# EAGLE design keypad (EAGLE 9.3.0)
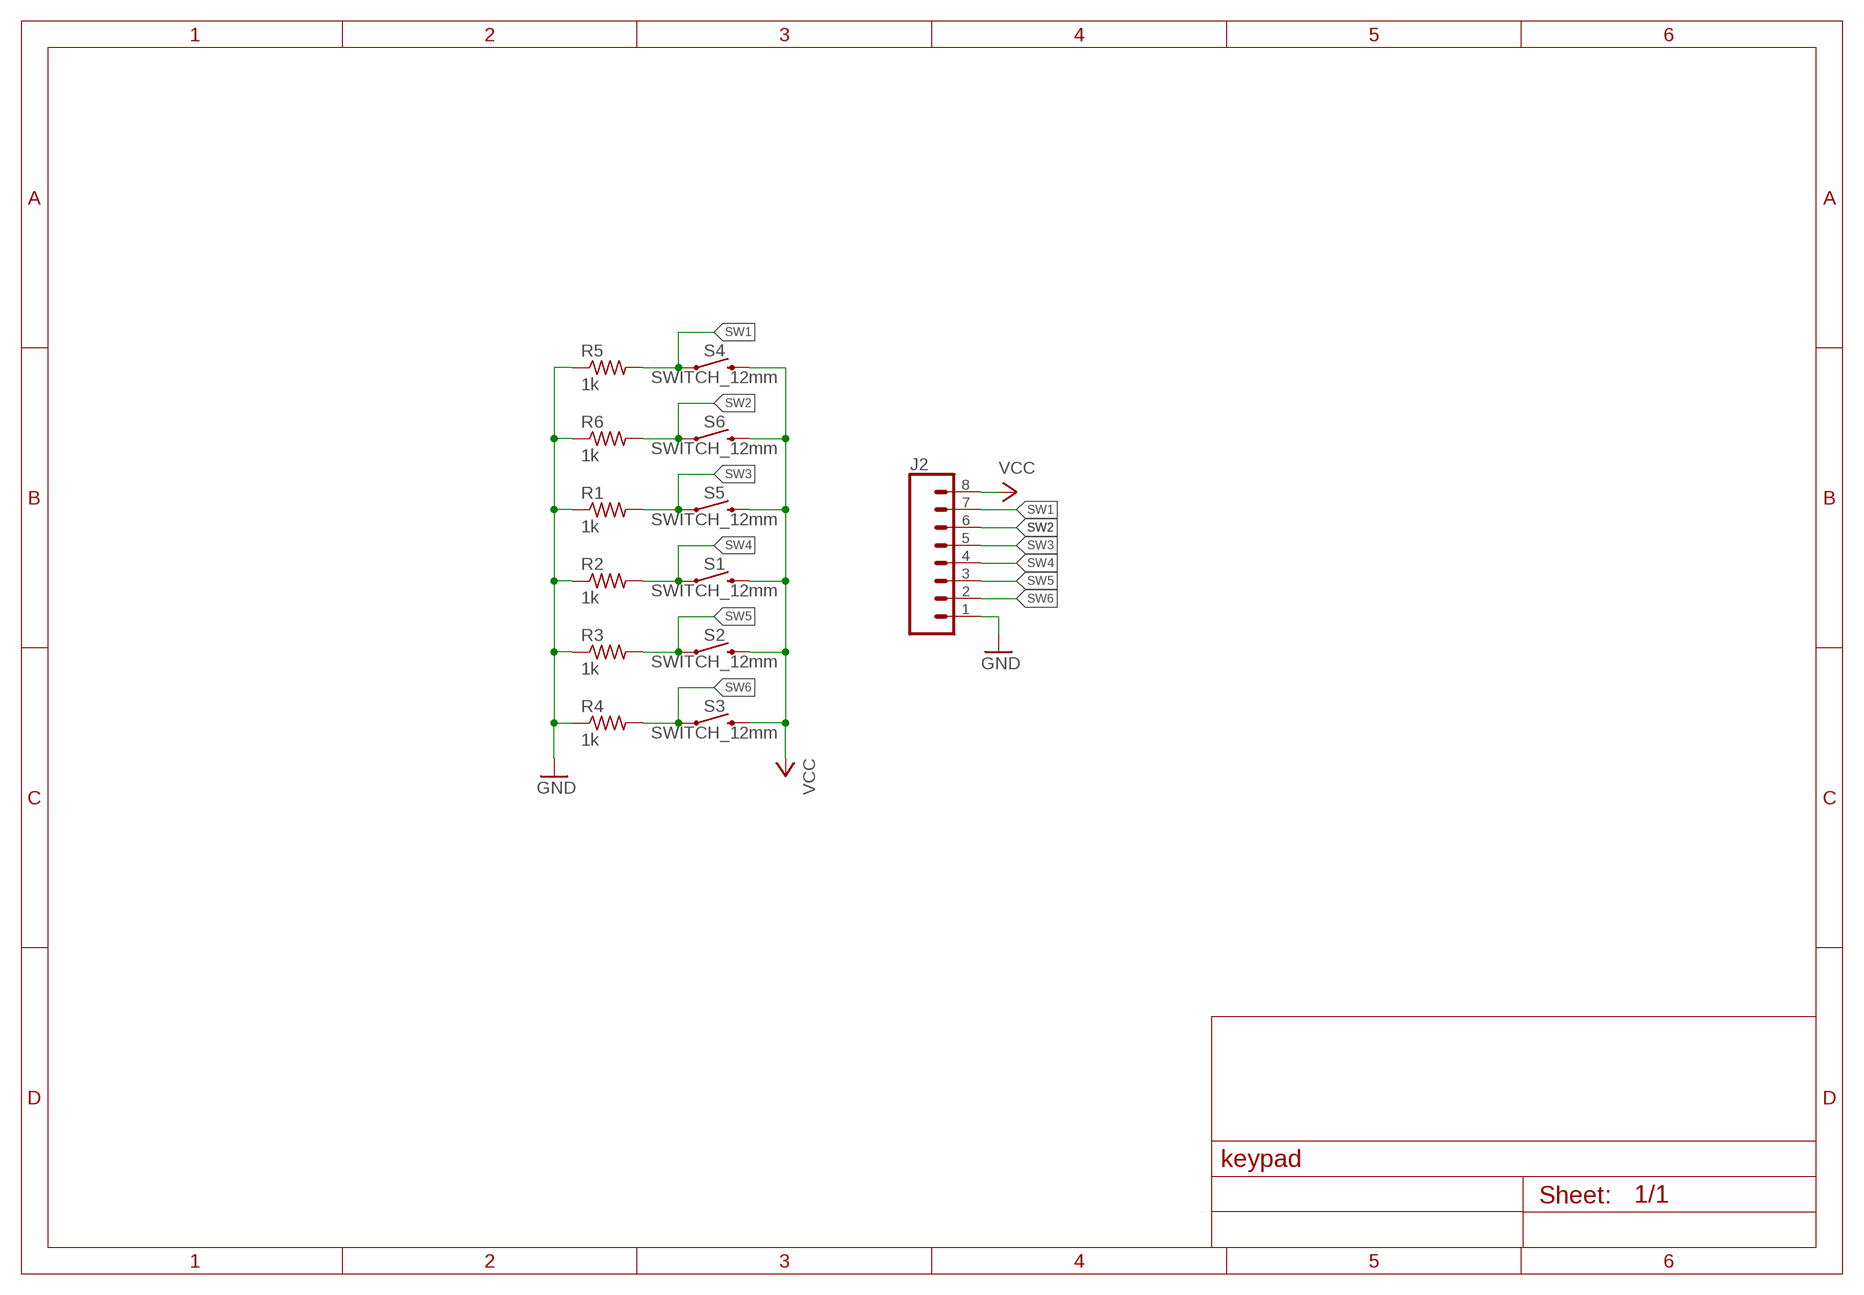
[diagram p0: schematic, sheet 1]

## Parts
J2  CONN_08LONGPADS  [1X08_LONGPADS]
R1  1k  R-US_0207/10  [0207/10]
R2  1k  R-US_0207/10  [0207/10]
R3  1k  R-US_0207/10  [0207/10]
R4  1k  R-US_0207/10  [0207/10]
R5  1k  R-US_0207/10  [0207/10]
R6  1k  R-US_0207/10  [0207/10]
S1  SWITCH_12mm  MOMENTARY-SWITCH-SPST-PTH-12MM  [TACTILE_SWITCH_PTH_12MM]
S2  SWITCH_12mm  MOMENTARY-SWITCH-SPST-PTH-12MM  [TACTILE_SWITCH_PTH_12MM]
S3  SWITCH_12mm  MOMENTARY-SWITCH-SPST-PTH-12MM  [TACTILE_SWITCH_PTH_12MM]
S4  SWITCH_12mm  MOMENTARY-SWITCH-SPST-PTH-12MM  [TACTILE_SWITCH_PTH_12MM]
S5  SWITCH_12mm  MOMENTARY-SWITCH-SPST-PTH-12MM  [TACTILE_SWITCH_PTH_12MM]
S6  SWITCH_12mm  MOMENTARY-SWITCH-SPST-PTH-12MM  [TACTILE_SWITCH_PTH_12MM]

## Nets
GND: J2.1 R1.1 R2.1 R3.1 R4.1 R5.1 R6.1
SW1: J2.7 R5.2 S4.1
SW2: J2.6 R6.2 S6.1
SW3: J2.5 R1.2 S5.1
SW4: J2.4 R2.2 S1.1
SW5: J2.3 R3.2 S2.1
SW6: J2.2 R4.2 S3.1
VCC: J2.8 S1.3 S2.3 S3.3 S4.3 S5.3 S6.3

## Library data of the parts
J2 = SparkFun-Connectors:CONN_08: Multi connection point. Often used as Generic Header-pin footprint for 0.1 inch spaced/style header connections On any of the 0.1 inch spaced packages, you can populate with these: Break Away Headers - Straight <https://www.sparkfun.com/products/116> (PRT-00116) Break Away Male Headers - Right Angle <https://www.sparkfun.com/products/553> (PRT-00553) Female Headers <https://www.sparkfun.com/products/115> (PRT-00115) Break Away Headers - Machine Pin <https://www.sparkfun.com/products/117> (PRT-00117) Break Away Female Headers - Swiss Machine Pin <https://www.sparkfun.com/products/743> (PRT-00743) Arduino Stackable Header - 8 Pin <https://www.sparkfun.com/products/9279> (PRT-09279) For SCREWTERMINALS and SPRING TERMINALS visit here: Screw Terimnals on SparkFun.com <https://www.sparkfun.com/search/results?term=Screw+Terminals> (5mm/3.5mm/2.54mm spacing) This device is also useful as a general connection point to wire up your design to another part of your project. Our various solder wires solder well into these plated through hole pads. Hook-Up Wire - Assortment (Stranded, 22 AWG) <https://www.sparkfun.com/products/11375> (PRT-11375) Hook-Up Wire - Assortment (Solid Core, 22 AWG) <https://www.sparkfun.com/products/11367> (PRT-11367) View the entire wire category on our website here <https://www.sparkfun.com/categories/141> Special notes: Molex polarized connector foot print use with SKU : PRT-08231 with associated crimp pins and housings. 1MM SMD Version SKU: PRT-10208 NOTES ON THE VARIANTS LOCK and LOCK_LONGPADS... This footprint was designed to help hold the alignment of a through-hole component (i.e. 6-pin header) while soldering it into place. You may notice that each hole has been shifted either up or down by 0.005 of an inch from it's more standard position (which is a perfectly straight line). This slight alteration caused the pins (the squares in the middle) to touch the edges of the holes. Because they are alternating, it causes a "brace" to hold the component in place. 0.005 has proven to be the perfect amount of "off-center" position when using our standard breakaway headers. Although looks a little odd when you look at the bare footprint, once you have a header in there, the alteration is very hard to notice. Also,if you push a header all the way into place, it is covered up entirely on the bottom side.
R1-R6 = BeagleBone_Black_Wireless:R-US_: RESISTOR, American symbol
S1-S6 = SparkFun-Switches:MOMENTARY-SWITCH-SPST: Momentary Switch (Pushbutton) - SPST Normally-open (NO) SPST momentary switches (buttons, pushbuttons). Variants PTH-12MM - 12mm square, through-hole Momentary Pushbutton Switch - 12mm Square <https://www.sparkfun.com/products/9190> (COM-09190) PTH-6.0MM, PTH-6.0MM-KIT - 6.0mm square, through-hole Mini Pushbutton Switch <https://www.sparkfun.com/products/97> (COM-00097) KIT package intended for soldering kit's - only one side of pads' copper is exposed. PTH-RIGHT-ANGLE-KIT - Right-angle, through-hole Right Angle Tactile Button <https://www.sparkfun.com/products/10791> - Used on SparkFun BigTime Watch Kit <https://www.sparkfun.com/products/11734> SMD-12MM - 12mm square, surface-mount Tactile Button - SMD (12mm) <https://www.sparkfun.com/products/12993> (COM-12993) Used on SparkFun PicoBoard <https://www.sparkfun.com/products/11888> SMD-4.5MM - 4.5mm Square Trackball Switch Used on SparkFun Blackberry Trackballer Breakout <https://www.sparkfun.com/products/13169> SMD-4.6MMX2.8MM - 4.60mm x 2.80mm, surface mount Used on SparkFun SAMD21 Mini Breakout <https://www.sparkfun.com/products/13664> SMD-5.2MM, SMD-5.2-REDUNDANT - 5.2mm square, surface-mount Mini Pushbutton Switch - SMD <https://www.sparkfun.com/products/8720> (COM-08720) Used on Arduino Pro Mini <https://www.sparkfun.com/products/11114> REDUNDANT package connects both switch circuits together SMD-6.0X3.5MM - 6.0 x 3.5mm, surface mount Momentary Reset Switch SMD <https://www.sparkfun.com/products/8229> (COM-08229) SMD-6.2MM-TALL - 6.2mm square, surface mount Tactile Button - SMD (6mm) <https://www.sparkfun.com/products/12992> Used on SparkFun Digital Sandbox <https://www.sparkfun.com/products/12651> SMD-RIGHT-ANGLE - Right-angle, surface mount Used on SparkFun Block for Intel® Edison - Arduino <https://www.sparkfun.com/products/13036>; PROD_ID: SWCH-09185; SF_SKU: COM-09190

## Board
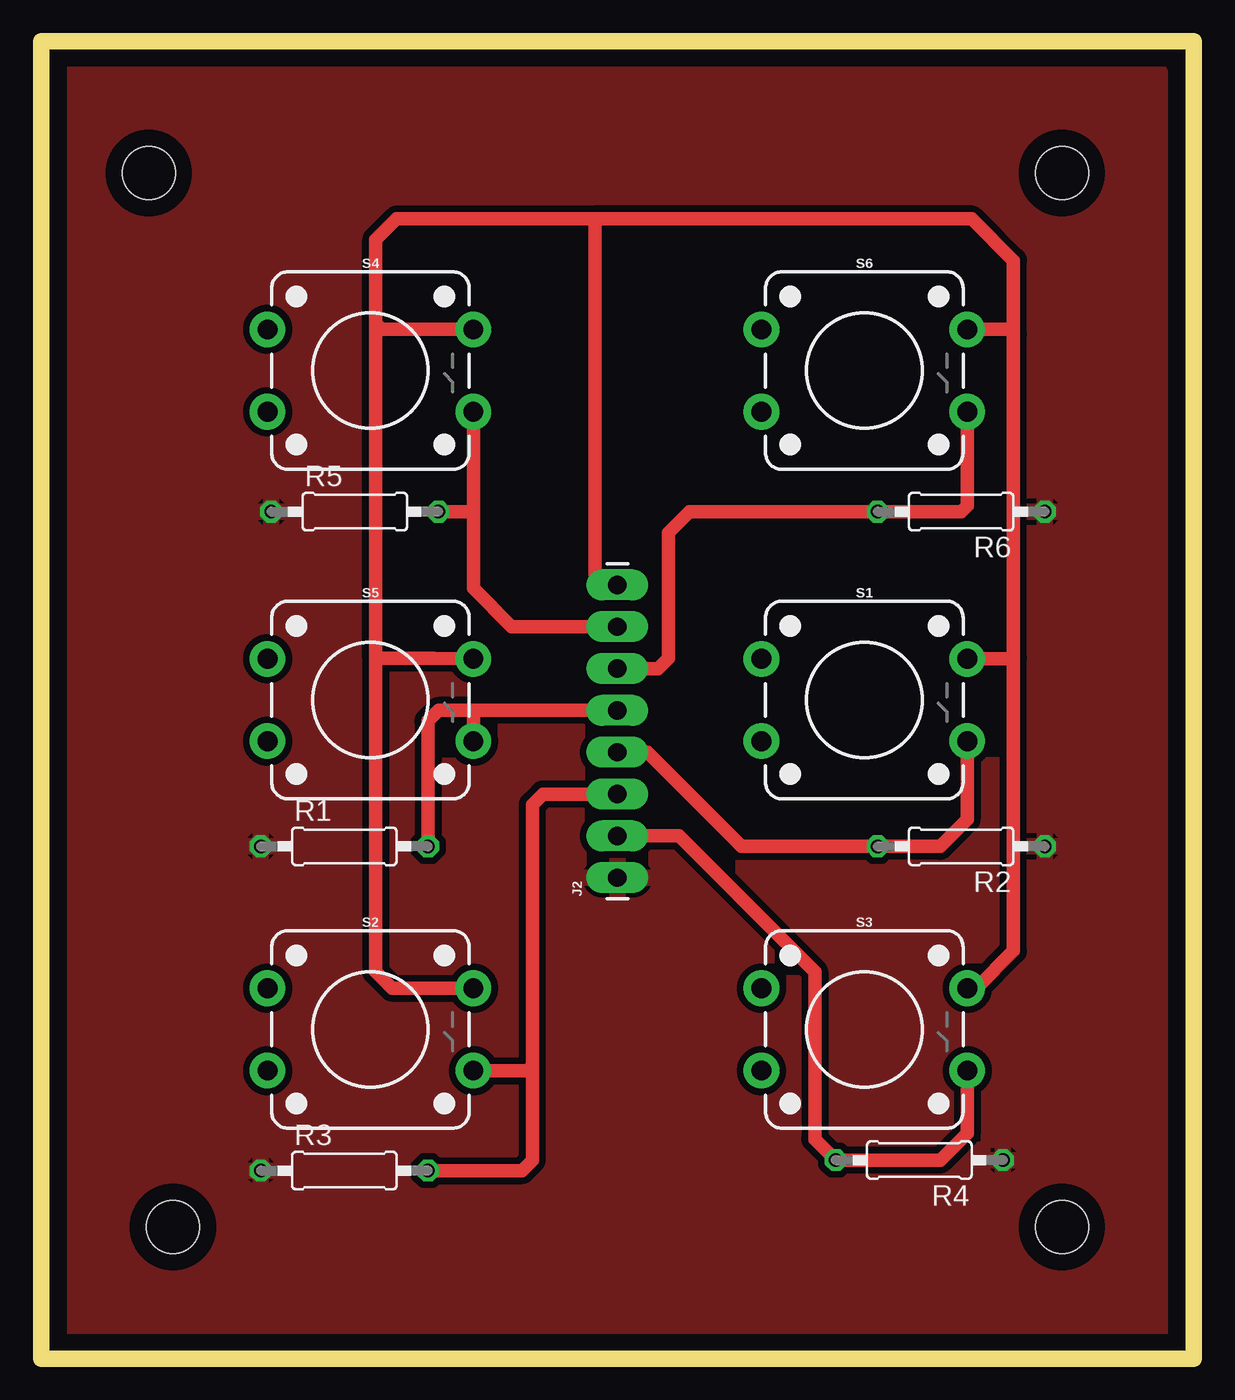
[diagram p1: board, top side]

Size 70 x 80 mm. Coordinates in mm from the lower left corner, seen from the top.
Outline: 0,0 70,0 70,80 0,80 0,0
Copper layers (1*16): Top 0.035mm / dielectric 1.5mm / Bottom 0.035mm
Design rules "default *": minimum track width 16mil, minimum drill 0.35mm, track to track 16mil, track to pad 16mil, pad to pad 16mil, via to via 16mil, smd to smd 16mil, copper to edge 40mil, drill to drill 6mil, minimum pad ring 10mil, minimum via ring 8mil, stop-mask expansion 4mil, vias tented up to drill 0mil, thermal gap 10mil
Holes 3.2 mm at 62,72 62,8 8,8 6.54,72

### Footprints (pad centres in the part's own frame; a part is rotated, then mirrored left to right if it is on the bottom)
1X08_LONGPADS = drill 1.118 pad 1.88 long: 1 0,0; 2 2.54,0; 3 5.08,0; 4 7.62,0; 5 10.16,0; 6 12.7,0; 7 15.24,0; 8 17.78,0
0207/10 = drill 0.813 octagon: 1 -5.08,0; 2 5.08,0
TACTILE_SWITCH_PTH_12MM = drill 1.2 pad 2.159: 1 6.25,-2.5; 2 -6.25,-2.5; 3 6.25,2.5; 4 -6.25,2.5

### Placement (x,y rotation side)
J2  35,29.21 90 top
R1  18.41,31.11 0 top
R2  55.88,31.11 180 top
R3  18.41,11.43 0 top
R4  53.34,12.06 180 top
R5  19.05,51.44 0 top
R6  55.88,51.44 180 top
S1  50,40 0 top
S2  20,20 0 top
S3  50,20 0 top
S4  20,60 0 top
S5  20,40 0 top
S6  50,60 0 top

### Tracks (layer width: path | path; a pad name or v marks a point on that pad's centre or on a via)
GND
  pour Top (isolate 0.406): 1.91,78.11 67.94,78.11 67.94,1.27 1.91,1.27
SW1
  Top 0.813: S4.1 26.25,51.44 | 26.25,51.44 26.25,46.77 28.57,44.45 J2.7 | R5.2 26.25,51.44
SW2
  Top 0.813: S6.1 56.25,51.8 55.88,51.44 R6.2 39.37,51.44 38.1,50.16 38.1,42.55 37.47,41.91 J2.6
SW3
  Top 0.813: J2.5 26.04,39.37 | 26.04,39.37 24.13,39.37 23.5,38.73 R1.2 | S5.1 26.25,39.16 26.04,39.37
SW4
  Top 0.813: S1.1 56.25,32.76 54.61,31.11 R2.2 42.55,31.11 36.83,36.83 J2.4
SW5
  Top 0.813: J2.3 30.48,34.29 29.84,33.66 29.84,17.78 | R3.2 29.21,11.43 29.84,12.06 29.84,17.78 | S2.1 29.57,17.5 29.84,17.78
SW6
  Top 0.813: S3.1 56.25,13.71 54.61,12.06 R4.2 46.99,13.34 46.99,23.5 38.73,31.75 J2.2
VCC
  Top 0.813: 20.32,42.55 20.32,23.5 21.32,22.5 S2.3 | S5.3 23.82,42.55 20.32,42.55 | S3.3 56.79,22.5 59.05,24.77 59.05,42.55 | J2.8 33.66,47.62 33.66,69.22 | 20.32,42.55 20.32,62.87 | 20.32,62.87 20.32,67.94 21.59,69.22 33.66,69.22 | S4.3 20.68,62.5 20.32,62.87 | 33.66,69.22 56.52,69.22 59.05,66.67 59.05,62.23 | 59.05,42.55 59.05,62.23 | S6.3 58.78,62.5 59.05,62.23 | S1.3 59.01,42.5 59.05,42.55